# EAGLE design climbingRGB (EAGLE 6.3)
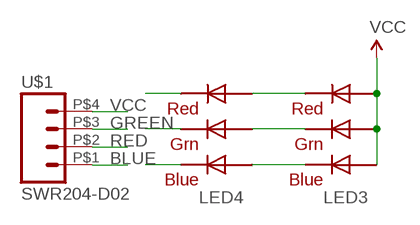
[diagram p0: schematic, sheet 1]

## Parts
LED3  RGBLED5050  [RGBLED5050]
LED4  RGBLED5050  [RGBLED5050]
U$1  SWR204-D02  [SWR204]

## Nets
BLUE: LED4.4(BLUE_C) U$1.P$1
GREEN: LED4.6(GREEN_C) U$1.P$3
N$1: LED3.4(BLUE_C) LED4.3(BLUE_A)
N$5: LED3.6(GREEN_C) LED4.1(GREEN_A)
N$6: LED3.5(RED_C) LED4.2(RED_A)
RED: LED4.5(RED_C) U$1.P$2
VCC: LED3.1(GREEN_A) LED3.2(RED_A) LED3.3(BLUE_A) U$1.P$4

## Library data of the parts
LED3 LED4 = adafruit:RGBLED: For 5050 RGB LEDs, the order of the LEDs may vary from one manufacturer to another!
U$1 = SparkFun-Connectors:SWR204-D02

## Board
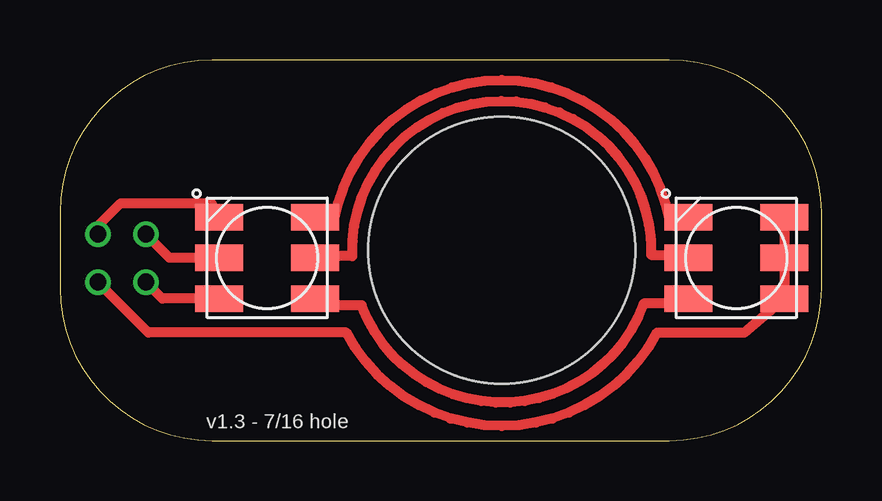
[diagram p1: board, top side]
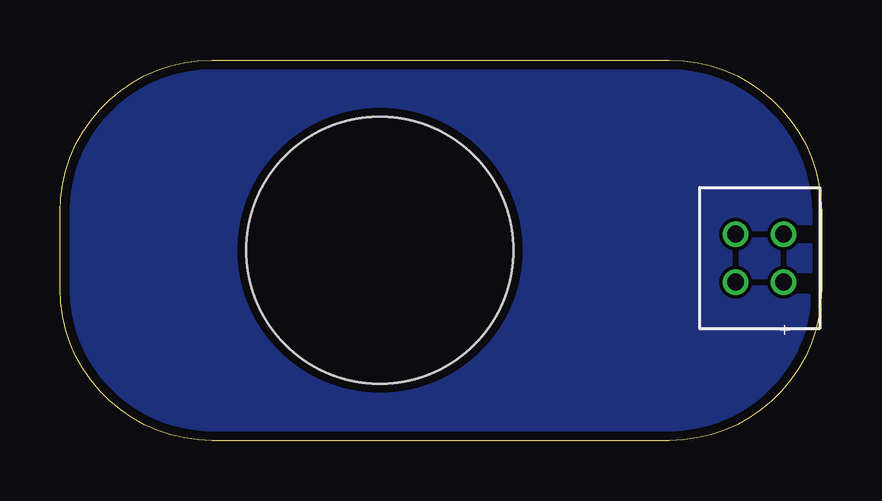
[diagram p2: board, bottom side, seen from below]

Size 31.75 x 15.88 mm. Coordinates in mm from the lower left corner, seen from the top.
Outline: 0,9.53 0,6.35 arc90 6.35,0 25.4,0 arc90 31.75,6.35 31.75,9.53 arc90 25.4,15.88 6.35,15.88 arc90 0,9.53
Copper layers (1*16): Top 0.0356mm / dielectric 1.5011mm / Bottom 0.0356mm
Design rules "LaenPCBOrder": minimum track width 6mil, minimum drill 13mil, track to track 6mil, track to pad 6mil, pad to pad 6mil, via to via 6mil, smd to smd 6mil, copper to edge 15mil, drill to drill 6mil, minimum pad ring 7mil, minimum via ring 7mil, stop-mask expansion 4mil, vias tented up to drill 0mil, thermal gap 10mil
Holes 11.11 mm at 18.41,7.94

### Footprints (pad centres in the part's own frame; a part is rotated, then mirrored left to right if it is on the bottom)
RGBLED5050 = smd 2 x 1.1: 1 -2,1.7; 2 -2,0; 3 -2,-1.7; 4 2,-1.7; 5 2,0; 6 2,1.7
SWR204 = drill 0.7: P$1 -0.99,0.96; P$2 -0.99,-1.04; P$3 1.01,-1.04; P$4 1.01,0.96

### Placement (x,y rotation side)
LED3  28.19,7.62 180 top
LED4  8.64,7.62 180 top
U$1  2.54,7.62 270 bottom

### Tracks (layer width: path | path; a pad name or v marks a point on that pad's centre or on a via)
BLUE
  Top 0.406: U$1.P$1 1.58,8.95 2.54,9.91 6.3,9.91 LED4.4
GND
  pour Bottom (rank 6): 31.75,9.53 31.75,6.35 arc-90 25.4,0 6.35,0 arc-90 0,6.35 0,9.53 arc-90 6.35,15.88 25.4,15.88 arc-90
GREEN
  Top 0.406: LED4.6 4.27,5.92 U$1.P$3
N$1
  Top 0.406: LED4.3 arc45 11.16,9.21 11.43,9.21 arc-159 25.4,9.21 25.67,9.21 arc45 LED3.4
N$5
  Top 0.406: 11.1,5.71 arc-90 LED4.1 10.89,5.64 12.57,5.64 arc139 24.33,5.69 24.33,5.71 25.73,5.71 arc90 LED3.6
N$6
  Top 0.406: LED4.2 10.89,7.7 12.19,7.7 arc-184 24.64,7.75 25.94,7.75 LED3.5
RED
  Top 0.406: LED4.5 4.57,7.62 U$1.P$2
VCC
  Top 0.406: LED3.3 LED3.2 LED3.1 | 29.97,5.89 LED3.1 | LED3.1 28.53,4.51 24.89,4.51 arc-124 11.94,4.51 3.68,4.51 U$1.P$4

### Text on the board
tNames: v1.3 - 7/16 hole
bNames: +